# EAGLE design 640mk6 (EAGLE 7.5.0)
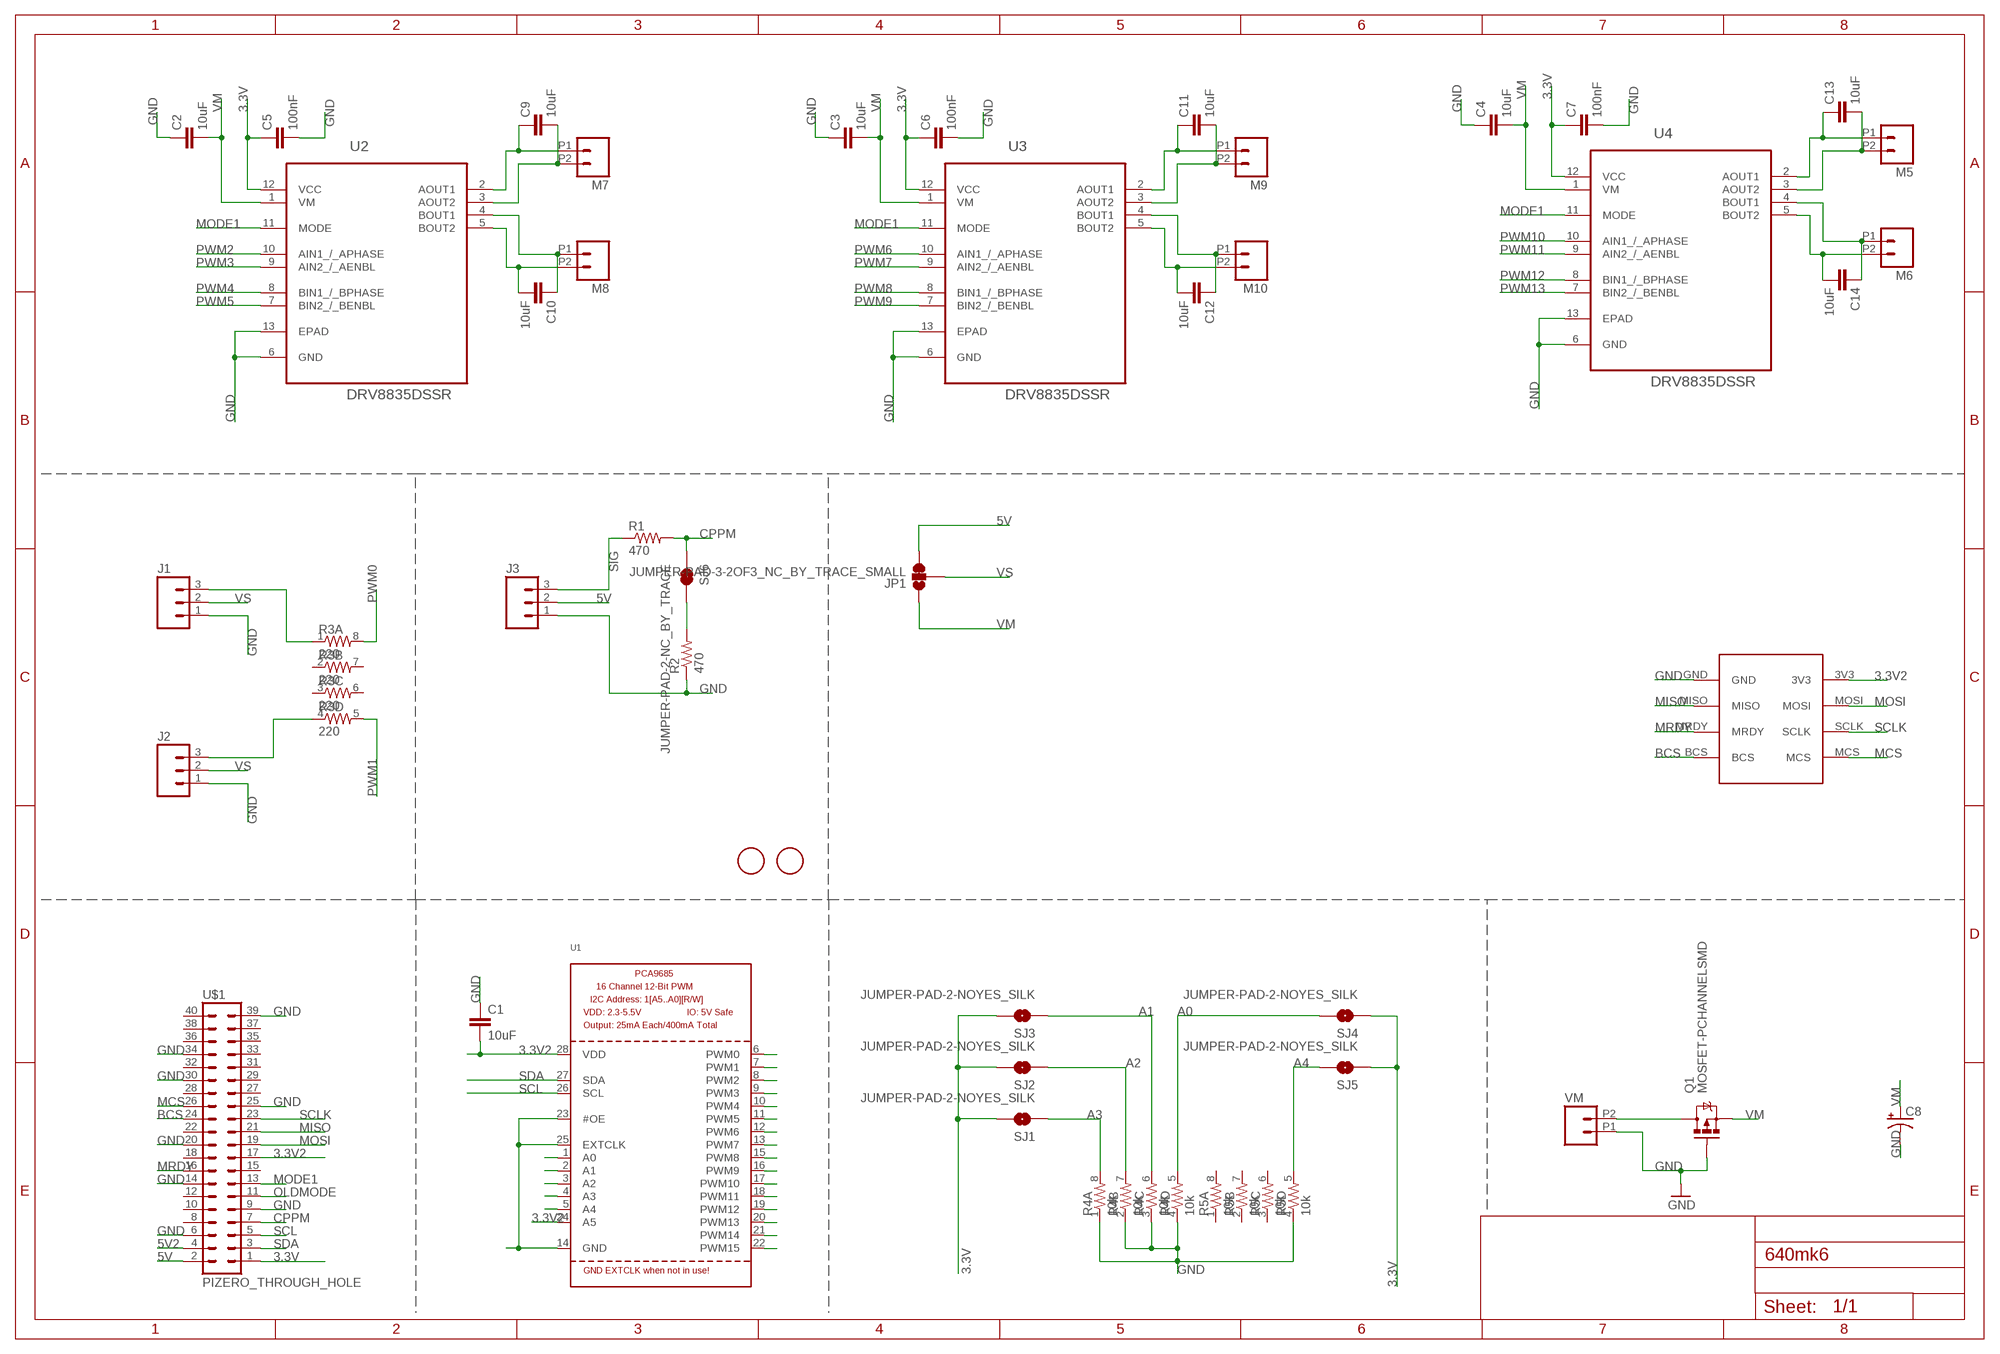
[diagram p0: schematic, sheet 1]

## Parts
C1  10uF  CAP0805  [0805]
C2  10uF  CAP0805  [0805]
C3  10uF  CAP0805  [0805]
C4  10uF  CAP0805  [0805]
C5  100nF  CAP0805  [0805]
C6  100nF  CAP0805  [0805]
C7  100nF  CAP0805  [0805]
C8  CAP_POLPTH1  [CPOL-RADIAL-100UF-25V]
C9  10uF  CAP0805  [0805]
C10  10uF  CAP0805  [0805]
C11  10uF  CAP0805  [0805]
C12  10uF  CAP0805  [0805]
C13  10uF  CAP0805  [0805]
C14  10uF  CAP0805  [0805]
FID1  FIDUCIAL  [FIDUCIAL_1MM]
FID2  FIDUCIAL  [FIDUCIAL_1MM]
J1  M03LOCK  [1X03_LOCK]
J2  M03LOCK  [1X03_LOCK]
J3  M03LOCK  [1X03_LOCK]
JP1  JUMPER-PAD-3-2OF3_NC_BY_TRACE_SMALL  [PAD-JUMPER-3-2OF3_NC_BY_TRACE_YES_SILK_FULL_BOX]
M5  M022.54MM_SCREWTERM  [1X02_2.54_SCREWTERM]
M6  M022.54MM_SCREWTERM  [1X02_2.54_SCREWTERM]
M7  M022.54MM_SCREWTERM  [1X02_2.54_SCREWTERM]
M8  M022.54MM_SCREWTERM  [1X02_2.54_SCREWTERM]
M9  M022.54MM_SCREWTERM  [1X02_2.54_SCREWTERM]
M10  M022.54MM_SCREWTERM  [1X02_2.54_SCREWTERM]
Q1  MOSFET-PCHANNELSMD  [SOT23-3]
R1  470  RESISTOR0805-RES  [0805]
R2  470  RESISTOR0805-RES  [0805]
R3  220  RESISTOR-ARRAY0603-ARV  [0603-ARV]
R4  10k  RESISTOR-ARRAY0603-ARV  [0603-ARV]
R5  10k  RESISTOR-ARRAY0603-ARV  [0603-ARV]
SJ1  JUMPER-PAD-2-NOYES_SILK  [PAD-JUMPER-2-NO_YES_SILK]
SJ2  JUMPER-PAD-2-NOYES_SILK  [PAD-JUMPER-2-NO_YES_SILK]
SJ3  JUMPER-PAD-2-NOYES_SILK  [PAD-JUMPER-2-NO_YES_SILK]
SJ4  JUMPER-PAD-2-NOYES_SILK  [PAD-JUMPER-2-NO_YES_SILK]
SJ5  JUMPER-PAD-2-NOYES_SILK  [PAD-JUMPER-2-NO_YES_SILK]
SJ6  JUMPER-PAD-2-NC_BY_TRACE  [PAD-JUMPER-2-NC_BY_TRACE_YES_SILK]
U1  PCA9685  [TSSOP28]
U2  DRV8835DSSR  [SON50P200X300X80-13N]
U3  DRV8835DSSR  [SON50P200X300X80-13N]
U4  DRV8835DSSR  [SON50P200X300X80-13N]
U$1  PIZERO_THROUGH_HOLE  [PIZERO_THOUGH_HOLE]
U$2  2X4PADS  [2X4PADS]
VM  M022.54MM_SCREWTERM  [1X02_2.54_SCREWTERM]

## Nets
3.3V: C5.1 C6.1 C7.1 SJ1.2 SJ2.2 SJ3.2 SJ4.1 SJ5.1 U2.12(VCC) U3.12(VCC) U4.12(VCC) U$1.1
3.3V2: C1.2 U1.24(A5) U1.28(VDD) U$1.17 U$2.3V3
5V: J3.2 JP1.3 U$1.2
5V2: U$1.4
A0: R4.5 SJ4.2 U1.1(A0)
A1: R4.6 SJ3.1 U1.2(A1)
A2: R4.7 SJ2.1 U1.3(A2)
A3: R4.8 SJ1.1 U1.4(A3)
A4: R5.5 SJ5.2 U1.5(A4)
BCS: U$1.24 U$2.BCS
CPPM: R1.2 SJ6.1 U$1.7
GND: C1.1 C2.1 C3.1 C4.1 C5.2 C6.2 C7.2 C8.2(-) J1.1 J2.1 J3.1 Q1.1(G) R2.1 R4.1 R4.2 R4.3 R4.4 R5.4 U1.14(GND) U1.23(#OE) U1.25(EXTCLK) U2.6(GND) U2.13(EPAD) U3.6(GND) U3.13(EPAD) U4.6(GND) U4.13(EPAD) U$1.6 U$1.9 U$1.14 U$1.20 U$1.25 U$1.30 U$1.34 U$1.39 U$2.GND VM.P1
MCS: U$1.26 U$2.MCS
MISO: U$1.21 U$2.MISO
MODE1: U2.11(MODE) U3.11(MODE) U4.11(MODE) U$1.13
MOSI: U$1.19 U$2.MOSI
MRDY: U$1.16 U$2.MRDY
N$1: R2.2 SJ6.2
N$2: J2.3 R3.4
N$4: J1.3 R3.1
N$5: Q1.3(D) VM.P2
N$10: C14.2 M6.P2 U4.5(BOUT2)
N$11: C14.1 M6.P1 U4.4(BOUT1)
N$12: C13.2 M5.P2 U4.3(AOUT2)
N$13: C13.1 M5.P1 U4.2(AOUT1)
N$14: C10.2 M8.P2 U2.5(BOUT2)
N$15: C10.1 M8.P1 U2.4(BOUT1)
N$16: C9.2 M7.P2 U2.3(AOUT2)
N$17: C9.1 M7.P1 U2.2(AOUT1)
N$18: C12.2 M10.P2 U3.5(BOUT2)
N$19: C12.1 M10.P1 U3.4(BOUT1)
N$20: C11.2 M9.P2 U3.3(AOUT2)
N$21: C11.1 M9.P1 U3.2(AOUT1)
OLDMODE: U$1.11
PWM0: R3.8 U1.6(PWM0)
PWM1: R3.5 U1.7(PWM1)
PWM2: U1.8(PWM2) U2.10(AIN1_/_APHASE)
PWM3: U1.9(PWM3) U2.9(AIN2_/_AENBL)
PWM4: U1.10(PWM4) U2.8(BIN1_/_BPHASE)
PWM5: U1.11(PWM5) U2.7(BIN2_/_BENBL)
PWM6: U1.12(PWM6) U3.10(AIN1_/_APHASE)
PWM7: U1.13(PWM7) U3.9(AIN2_/_AENBL)
PWM8: U1.15(PWM8) U3.8(BIN1_/_BPHASE)
PWM9: U1.16(PWM9) U3.7(BIN2_/_BENBL)
PWM10: U1.17(PWM10) U4.10(AIN1_/_APHASE)
PWM11: U1.18(PWM11) U4.9(AIN2_/_AENBL)
PWM12: U1.19(PWM12) U4.8(BIN1_/_BPHASE)
PWM13: U1.20(PWM13) U4.7(BIN2_/_BENBL)
PWM14: U1.21(PWM14)
PWM15: U1.22(PWM15)
SCL: U1.26(SCL) U$1.5
SCLK: U$1.23 U$2.SCLK
SDA: U1.27(SDA) U$1.3
SIG: J3.3 R1.1
VM: C2.2 C3.2 C4.2 C8.1(+) JP1.1 Q1.2(S) U2.1(VM) U3.1(VM) U4.1(VM)
VS: J1.2 J2.2 JP1.2
Unconnected: R3.2 R3.3 R3.6 R3.7 R5.1 R5.2 R5.3 R5.6 R5.7 R5.8 U$1.8 U$1.10 U$1.12 U$1.15 U$1.18 U$1.22 U$1.27 U$1.28 U$1.29 U$1.31 U$1.32 U$1.33 U$1.35 U$1.36 U$1.37 U$1.38 U$1.40

## Library data of the parts
C1-C7 C9-C14 = SparkFun-Passives:CAP: Capacitor Standard 0603 ceramic capacitor, and 0.1" leaded capacitor.
C8 = SparkFun-Passives:CAP_POL: Capacitor Polarized These are standard SMD and PTH capacitors. Normally 10uF, 47uF, and 100uF in electrolytic and tantalum varieties. Always verify the external diameter of the through hole cap, it varies with capacity, voltage, and manufacturer. The EIA devices should be standard.
FID1 FID2 = adafruit:FIDUCIAL: For use by pick and place machines to calibrate the vision/machine, 1mm By microbuilder.eu
J1-J3 = SparkFun-Connectors:M03: Header 3 Standard 3-pin 0.1" header. Use with straight break away headers (SKU : PRT-00116), right angle break away headers (PRT-00553), swiss pins (PRT-00743), machine pins (PRT-00117), and female headers (PRT-00115). Molex polarized connector foot print use with SKU : PRT-08232 with associated crimp pins and housings.
JP1 = SparkFun-Passives:JUMPER-PAD-3-2OF3_NC_BY_TRACE
M5-M10 VM = SparkFun-Connectors:M02: Standard 2-pin 0.1" header. Use with - straight break away headers ( PRT-00116) - right angle break away headers (PRT-00553) - swiss pins (PRT-00743) - machine pins (PRT-00117) - female headers (PRT-00115) Molex polarized connector foot print use with: PRT-08233 with associated crimp pins and housings. 2.54_SCREWTERM for use with PRT-10571. 3.5mm Screw Terminal footprints for PRT-08084 5mm Screw Terminal footprints for use with PRT-08432
Q1 = SparkFun-DiscreteSemi:MOSFET-PCHANNEL: Generic PMOSFET IRLML2244 - TRANS-11153 (SOT-23 -20V -4.3A) (1.Gate 2.Source 3.Drain) FQP27P06 - COM-10349 <http://www.sparkfun.com/products/10349> (TO-220 -60V -27A) (1.Gate 2.Source 3.Drain)
R1 R2 = SparkFun-Passives:RESISTOR: Resistor Basic schematic elements and footprints for 0603, 1206, and PTH resistors.
R3-R5 = SparkFun-Passives:RESISTOR-ARRAY: Array Chip Resistor Source: RS Component / Phycomp
SJ1-SJ5 = SparkFun-Passives:JUMPER-PAD-2-NO
SJ6 = SparkFun-Passives:JUMPER-PAD-2-NC_BY_TRACE
U1 = adafruit:PCA9685: PCA9685 - 16 Channel 12-Bit I2C PWM Controller 5.0V tolerant 16 channel, 12-bit I2C PWM controller with 25mA per output (max. 400mA total) Digikey: 568-5931-1-ND
U2-U4 = drv8835:DRV8835DSSR: DUAL LOW VOLTAGE H-BRIDGE IC,SON-12; MPN: DRV8835DSSR; OC_FARNELL: 2115235; OC_NEWARK: 94T6065; PACKAGE: SON-12; SUPPLIER: TEXAS INSTRUMENTS
U$1 = pizero:PIZERO_THROUGH_HOLE
U$2 = expansion:2X4PADS

## Board
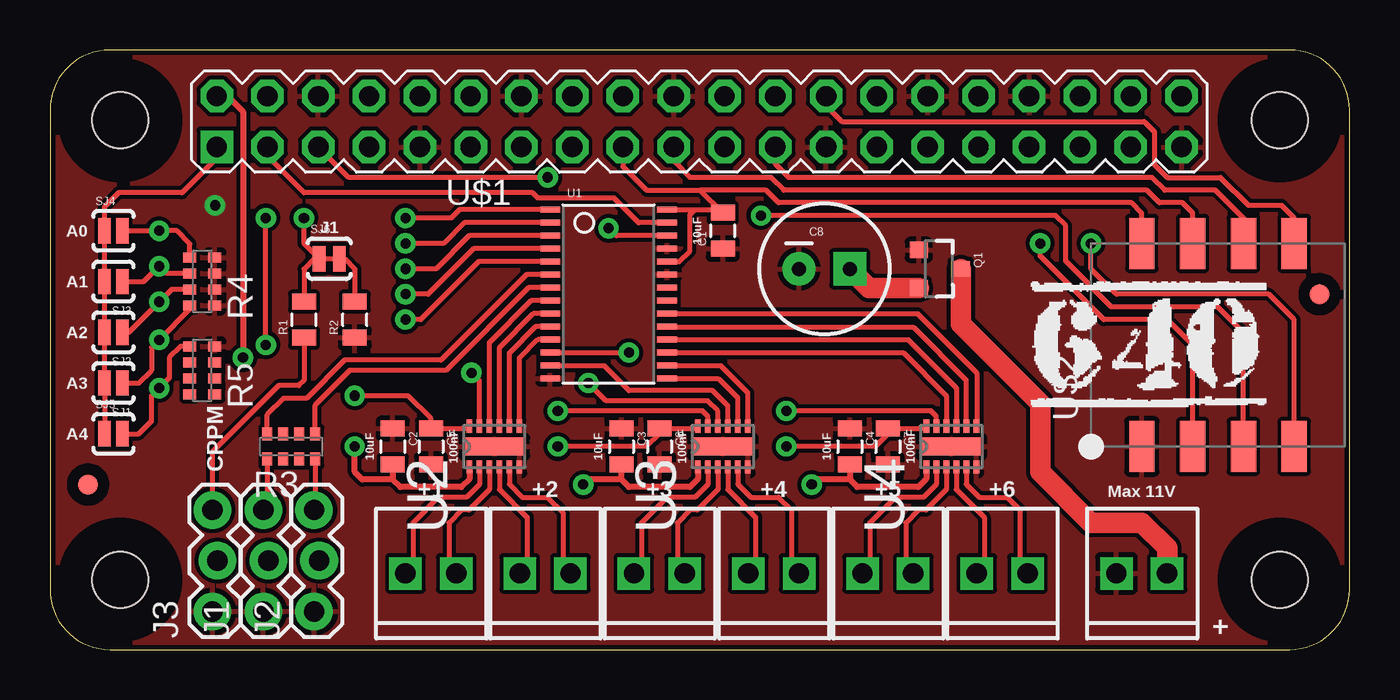
[diagram p1: board, top side]
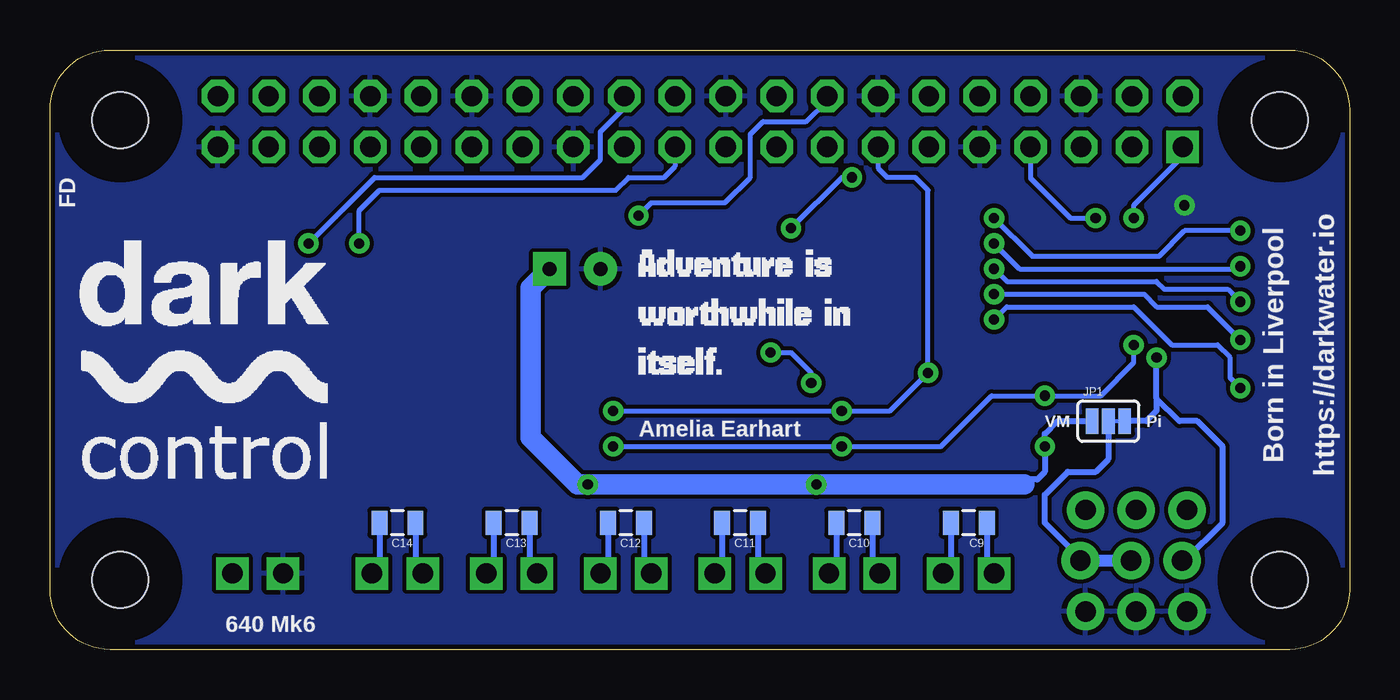
[diagram p2: board, bottom side, seen from below]

Size 65 x 30 mm. Coordinates in mm from the lower left corner, seen from the top.
Copper layers (1*16): Top 0.035mm / dielectric 1.5mm / Bottom 0.035mm
Design rules "SparkFun": minimum track width 8mil, minimum drill 20mil, track to track 8mil, track to pad 8mil, pad to pad 8mil, via to via 8mil, smd to smd 8mil, copper to edge 10mil, drill to drill 8mil, minimum pad ring 12mil, minimum via ring 10mil, stop-mask expansion 4mil, vias tented up to drill 25mil, thermal gap 10mil

### Footprints (pad centres in the part's own frame; a part is rotated, then mirrored left to right if it is on the bottom)
0805 = smd 0.8 x 1.2: 1 -0.9,0; 2 0.9,0
CPOL-RADIAL-100UF-25V = drill 0.7 pad 1.651 square: 1 1.27,0 | drill 0.7 pad 1.651: 2 -1.27,0
FIDUCIAL_1MM = smd 1 x 1: 1 0,0
1X03_LOCK = drill 1.016 pad 1.88: 1 0,0.127; 2 2.54,-0.127; 3 5.08,0.127
PAD-JUMPER-3-2OF3_NC_BY_TRACE_YES_SILK_FULL_BOX = smd 0.635 x 1.27: 1 -0.813,0; 2 0,0; 3 0.813,0
1X02_2.54_SCREWTERM = drill 1.016 square: P1 2.54,0; P2 0,0
SOT23-3 = smd 0.8 x 0.9: 1 -0.95,-1; 2 0.95,-1; 3 0,1.1
0603-ARV = smd 0.5 x 0.65: 1 -1.2,-0.625; 2 -0.4,-0.625; 3 0.4,-0.625; 4 1.2,-0.625; 5 1.2,0.625; 6 0.4,0.625; 7 -0.4,0.625; 8 -1.2,0.625
PAD-JUMPER-2-NO_YES_SILK = smd 0.635 x 1.27: 1 -0.45,0; 2 0.45,0
PAD-JUMPER-2-NC_BY_TRACE_YES_SILK = smd 0.635 x 1.27: 1 -0.508,0; 2 0.508,0
TSSOP28 = smd 0.305 x 0.991: 1 -4.225,-2.918; 2 -3.575,-2.918; 3 -2.925,-2.918; 4 -2.275,-2.918; 5 -1.625,-2.918; 6 -0.975,-2.918; 7 -0.325,-2.918; 8 0.325,-2.918; 9 0.975,-2.918; 10 1.625,-2.918; 11 2.275,-2.918; 12 2.925,-2.918; 13 3.575,-2.918; 14 4.225,-2.918; 15 4.225,2.918; 16 3.575,2.918; 17 2.925,2.918; 18 2.275,2.918; 19 1.625,2.918; 20 0.975,2.918; 21 0.325,2.918; 22 -0.325,2.918; 23 -0.975,2.918; 24 -1.625,2.918; 25 -2.275,2.918; 26 -2.925,2.918; 27 -3.575,2.918; 28 -4.225,2.918
SON50P200X300X80-13N = smd 0.66 x 0.28: 1 -1.016,1.25; 2 -1.016,0.75; 3 -1.016,0.25; 4 -1.016,-0.25; 5 -1.016,-0.75; 6 -1.016,-1.25; 7 1.016,-1.25; 8 1.016,-0.75; 9 1.016,-0.25; 10 1.016,0.25; 11 1.016,0.75; 12 1.016,1.25 | smd 0.9 x 3.099: 13 0,0
PIZERO_THOUGH_HOLE = drill 1.016 square: 1 8.34,25.15 | drill 1.016 octagon: 2 8.34,27.69; 3 10.88,25.15; 4 10.88,27.69; 5 13.42,25.15; 6 13.42,27.69; 7 15.96,25.15; 8 15.96,27.69; 9 18.5,25.15; 10 18.5,27.69; 11 21.04,25.15; 12 21.04,27.69; 13 23.58,25.15; 14 23.58,27.69; 15 26.12,25.15; 16 26.12,27.69; 17 28.66,25.15; 18 28.66,27.69; 19 31.2,25.15; 20 31.2,27.69; 21 33.74,25.15; 22 33.74,27.69; 23 36.28,25.15; 24 36.28,27.69; 25 38.82,25.15; 26 38.82,27.69; 27 41.36,25.15; 28 41.36,27.69; 29 43.9,25.15; 30 43.9,27.69; 31 46.44,25.15; 32 46.44,27.69; 33 48.98,25.15; 34 48.98,27.69; 35 51.52,25.15; 36 51.52,27.69; 37 54.06,25.15; 38 54.06,27.69; 39 56.6,25.15; 40 56.6,27.69 | hole 2.8: 3.5,3.5; 3.5,26.5; 61.5,26.5; 61.5,3.5
2X4PADS = smd 2.54 x 1.27: 3V3 5.08,3.81; BCS -5.08,-3.81; GND -5.08,3.81; MCS 5.08,-3.81; MISO -5.08,1.27; MOSI 5.08,1.27; MRDY -5.08,-1.27; SCLK 5.08,-1.27

### Placement (x,y rotation side)
C1  33.66,20.95 90 top
C2  17.14,10.16 270 top
C3  28.57,10.16 270 top
C4  40.01,10.16 270 top
C5  19.05,10.16 270 top
C6  30.48,10.16 270 top
C7  41.91,10.16 270 top
C8  38.73,19.05 0 top
C9  19.05,6.35 180 bottom
C10  24.77,6.35 180 bottom
C11  30.48,6.35 180 bottom
C12  36.2,6.35 180 bottom
C13  41.91,6.35 180 bottom
C14  47.62,6.35 180 bottom
FID1  1.91,8.26 0 top
FID2  63.5,17.78 0 top
J1  10.79,1.91 90 top
J2  13.34,1.91 90 top
J3  8.26,1.91 90 top
JP1  12.06,11.43 0 bottom
M5  43.18,3.81 180 top
M6  48.9,3.81 180 top
M7  20.32,3.81 180 top
M8  26.04,3.81 180 top
M9  31.75,3.81 180 top
M10  37.47,3.81 180 top
Q1  44.45,19.05 270 top
R1  12.7,16.51 90 top
R2  15.24,16.51 90 top
R3  12.06,10.16 0 top
R4  7.62,18.41 90 top
R5  7.62,13.97 90 top
SJ1  3.17,13.34 180 top
SJ2  3.17,15.88 180 top
SJ3  3.17,18.41 180 top
SJ4  3.17,20.95 0 top
SJ5  3.17,10.79 0 top
SJ6  13.97,19.56 0 top
U1  27.94,17.78 270 top
U2  22.23,10.16 90 top
U3  33.66,10.16 90 top
U4  45.09,10.16 90 top
U$1  0,0 0 top
U$2  58.42,15.24 90 top
U$3  [DARKCONTROLSML]  63.5,8.26 0 bottom
U$4  [640HORIZ]  48.26,11.43 0 top
U$5  [ADVENTURE]  36.96,12.95 0 bottom
VM  55.88,3.81 180 top

### Tracks (layer width: path | path; a pad name or v marks a point on that pad's centre or on a via)
3.3V  (via drill 0.51)
  Top 0.254: SJ5.1 SJ1.2 SJ2.2 SJ3.2 SJ4.1 2.73,22.16 3.43,22.86 6.6,22.86 8.38,24.64 8.38,25.11 U$1.1 | v10.79,15.24 v10.79,21.59 | v25.4,10.16 29.84,10.16 30.48,10.79 C6.1 32.29,11.06 U3.12 | v36.83,10.16 41.27,10.16 41.91,10.79 C7.1 43.72,11.06 U4.12 | U2.12 20.86,11.06 C5.1 19.05,11.56 17.91,12.7 v15.24,12.7
  Bottom 0.254: v10.79,21.59 10.79,22.23 8.34,24.68 U$1.1 | v10.79,15.24 10.79,14.35 12.45,12.7 v15.24,12.7 17.91,12.7 20.45,10.16 v25.4,10.16 v36.83,10.16
3.3V2
  Top 0.254: U1.28 32.26,22 | 32.26,22 33.51,22 C1.2 32.52,22.99 | U1.24 31.47,19.41 32,19.94 32,21.75 32.26,22 | U$2.3V3 54.61,21.84 54.1,22.35 36.45,22.35 35.81,22.99 32.52,22.99 | U$1.17 28.66,24.17 29.84,22.99 32.52,22.99
5V  (via drill 0.51)
  Top 0.305: U$1.2 8.89,27.69 9.65,26.92 v9.65,14.61
  Bottom 0.305: J3.2 8.26,4.45 6.35,6.35 6.35,10.16 7.62,11.43 8.51,11.43 9.65,12.57 | 9.65,12.57 v9.65,14.61 | 9.65,12.57 9.65,11.94 10.16,11.43 JP1.3
A0  (via drill 0.51)
  Top 0.254: 6.99,19.62 R4.5 7,20.31 6.35,20.95 v5.46,20.95 SJ4.2 | U1.1 20.48,22 20.07,21.59 v17.78,21.59
  Bottom 0.254: v5.46,20.95 8.26,20.95 9.53,19.68 15.88,19.68 v17.78,21.59
A1  (via drill 0.51)
  Top 0.254: SJ3.1 4.7,18.41 v5.46,19.18 5.82,18.82 R4.6 | U1.2 20.72,21.36 19.68,20.32 v17.78,20.32
  Bottom 0.254: v5.46,19.18 5.59,19.05 16.51,19.05 v17.78,20.32
A2  (via drill 0.51)
  Top 0.254: SJ2.1 3.94,15.88 v5.46,17.4 6.08,18.02 R4.7 | U1.3 20.96,20.7 19.3,19.05 v17.78,19.05
  Bottom 0.254: 5.84,17.78 v5.46,17.4 6.1,18.03 9.27,18.03 9.65,18.41 17.14,18.41 v17.78,19.05
A3  (via drill 0.51)
  Top 0.254: SJ1.1 4.45,13.34 5.08,13.97 5.08,15.11 v5.46,15.49 7,17.03 R4.8 | U1.4 21.2,20.05 18.92,17.78 v17.78,17.78
  Bottom 0.254: 6.6,16.64 v5.46,15.49 7.11,17.14 9.65,17.14 10.29,17.78 v17.78,17.78
A4  (via drill 0.51)
  Top 0.254: SJ5.2 4.45,10.79 5.08,11.43 5.08,12.7 v5.46,13.08 5.97,13.59 5.97,14.61 6.53,15.17 R5.5 | U1.5 21.44,19.41 18.54,16.51 v17.78,16.51
  Bottom 0.254: v5.46,13.08 5.97,13.59 5.97,14.61 6.6,15.24 8.89,15.24 10.79,17.14 17.14,17.14 v17.78,16.51
BCS  (via drill 0.51)
  Top 0.254: U$2.BCS 62.23,16.51 60.96,17.78 53.34,17.78 52.07,19.05 v52.07,20.32
  Bottom 0.254: v52.07,20.32 48.77,23.62 38.35,23.62 37.47,24.51 37.47,25.91 36.28,27.09 U$1.24
CPPM  (via drill 0.51)
  Top 0.254: v12.7,21.59 12.7,20.32 SJ6.1 13.21,19.56 12.7,19.05 R1.2
  Bottom 0.254: U$1.7 15.96,23.58 13.97,21.59 v12.7,21.59
GND  (via drill 0.51)
  other vias: 8.26,22.23
  pour Bottom: 0,27.3 0,2.54 arc90 2.54,0 62.23,0 arc90 64.77,2.54 64.77,27.3 arc90 62.23,29.84 2.54,29.84 arc90
  pour Top: 0,27.3 0,2.54 arc90 2.54,0 62.23,0 arc90 64.77,2.54 64.77,27.3 arc90 62.23,29.84 2.54,29.84 arc90
MCS
  Top 0.254: U$1.26 38.82,27.22 39.62,26.42 54.74,26.42 55.24,25.91 55.24,24.26 55.88,23.62 58.55,23.62 59.94,22.23 61.59,22.23 62.23,21.59 U$2.MCS
MISO  (via drill 0.51)
  Top 0.254: U$2.MISO 57.15,15.24 55.88,16.51 52.7,16.51 49.53,19.68 v49.53,20.32
  Bottom 0.254: v49.53,20.32 49.53,21.97 48.51,22.99 36.7,22.99 36.07,23.62 34.29,23.62 33.74,24.17 U$1.21
MODE1  (via drill 0.51)
  Top 0.254: U3.11 32.91,11.67 32.64,11.94 v25.4,11.94 | U2.11 21.48,13.45 v21.08,13.84 | U4.11 44.34,11.67 44.07,11.94 v36.83,11.94
  Bottom 0.254: v36.83,11.94 v25.4,11.94 22.99,11.94 v21.08,13.84 21.08,22.99 21.72,23.62 23.11,23.62 23.58,24.09 U$1.13
MOSI
  Top 0.254: U$2.MOSI 57.15,21.84 56.64,22.35 55.5,22.35 54.86,22.99 36.7,22.99 36.07,23.62 32,23.62 31.2,24.43 U$1.19
MRDY  (via drill 0.51)
  Top 0.254: U$2.MRDY 59.69,15.88 58.42,17.14 53.09,17.14 50.8,19.43 50.8,21.21 50.29,21.72 v35.56,21.72
  Bottom 0.254: v35.56,21.72 34.92,22.35 31.24,22.35 29.97,23.62 29.97,25.78 29.34,26.42 27.18,26.42 26.12,27.47 U$1.16
N$1
  Top 0.254: SJ6.2 14.73,19.56 15.24,19.05 R2.2
N$2
  Top 0.254: R3.4 13.27,7.04 J2.3
N$4
  Top 0.254: R3.1 10.87,7.18 J1.3
N$5
  Top 1.016: Q1.3 45.55,16.3 49.53,12.32 49.53,8.89 52.07,6.35 54.61,6.35 55.88,5.08 VM.P2
N$10
  Top 0.254: U4.5 45.84,8.27 46.48,7.62 47.88,7.62 48.51,6.99 48.51,4.19 M6.P2
  Bottom 0.305: C14.2 48.52,4.18 M6.P2
N$11
  Top 0.254: U4.4 45.34,8.01 46.73,6.62 46.73,4.18 M6.P1
  Bottom 0.305: C14.1 46.73,4.18 M6.P1
N$12
  Top 0.254: U4.3 44.84,8.01 43.81,6.99 43.45,6.99 C13.2 42.81,4.18 M5.P2
  Bottom 0.305: C13.2 42.81,4.18 M5.P2
N$13
  Top 0.254: U4.2 44.34,8.27 43.69,7.62 42.28,7.62 C13.1 41.01,4.18 M5.P1
  Bottom 0.305: C13.1 41.01,4.18 M5.P1
N$14
  Top 0.254: U2.5 22.98,8.27 23.62,7.62 24.89,7.62 25.65,6.86 25.65,4.19 M8.P2
  Bottom 0.305: C10.2 25.66,4.18 M8.P2
N$15
  Top 0.254: U2.4 22.48,8.01 23.86,6.62 23.86,4.18 M8.P1
  Bottom 0.305: C10.1 23.86,4.18 M8.P1
N$16
  Top 0.254: U2.3 21.98,8.01 20.95,6.99 20.59,6.99 C9.2 19.95,4.18 M7.P2
  Bottom 0.305: C9.2 19.95,4.18 M7.P2
N$17
  Top 0.254: U2.2 21.48,8.27 20.83,7.62 19.42,7.62 C9.1 18.15,4.18 M7.P1
  Bottom 0.305: C9.1 18.15,4.18 M7.P1
N$18
  Top 0.254: U3.5 34.41,8.27 35.05,7.62 36.45,7.62 37.08,6.99 37.08,4.19 M10.P2
  Bottom 0.305: C12.2 37.09,4.18 M10.P2
N$19
  Top 0.254: U3.4 33.91,8.01 35.3,6.62 35.3,4.18 M10.P1
  Bottom 0.305: C12.1 35.3,4.18 M10.P1
N$20
  Top 0.254: U3.3 33.41,8.01 32.38,6.99 32.02,6.99 C11.2 31.38,4.18 M9.P2
  Bottom 0.305: C11.2 31.38,4.18 M9.P2
N$21
  Top 0.254: U3.2 32.91,8.27 32.26,7.62 30.85,7.62 C11.1 29.58,4.18 M9.P1
  Bottom 0.305: C11.1 29.58,4.18 M9.P1
PWM0
  Top 0.254: U1.6 23.84,18.75 19.56,14.48 14.73,14.48 12.83,12.57 11.68,12.57 10.87,11.75 R3.8
PWM1
  Top 0.254: U1.7 23.95,18.11 19.81,13.97 14.99,13.97 13.27,12.25 R3.5
PWM2
  Top 0.254: U2.10 21.98,15.37 24.06,17.45 U1.8
PWM3
  Top 0.254: U2.9 22.48,15.11 24.17,16.8 U1.9
PWM4
  Top 0.254: U2.8 22.98,14.85 24.28,16.16 U1.10
PWM5
  Top 0.254: U2.7 23.48,14.59 24.39,15.51 U1.11
PWM6  (via drill 0.51)
  Top 0.254: U3.10 33.41,11.93 32.89,12.45 27.81,12.45 v26.92,13.34 | U1.12 v28.95,14.86 v28.96,14.86
  Bottom 0.254: v26.92,13.34 26.92,13.84 27.94,14.86 v28.96,14.86
PWM7
  Top 0.254: U1.13 27.7,14.21 28.96,12.95 33.15,12.95 33.91,12.2 U3.9
PWM8
  Top 0.254: U1.15 33.44,13.55 34.41,12.59 U3.8
PWM9
  Top 0.254: U1.16 33.55,14.21 34.91,12.85 U3.7
PWM10
  Top 0.254: U1.17 42.68,14.86 44.83,12.7 U4.10
PWM11
  Top 0.254: U1.18 42.91,15.51 45.34,13.08 U4.9
PWM12
  Top 0.254: U4.8 45.84,13.47 43.18,16.13 30.88,16.13 U1.19
PWM13
  Top 0.254: U1.20 43.39,16.8 46.35,13.84 46.35,11.2 U4.7
SCL  (via drill 0.51)
  Top 0.254: v24.89,23.62 14.95,23.62 U$1.5 | U1.26 28.32,20.7 v27.94,21.08
  Bottom 0.254: v24.89,23.62 25.4,23.62 v27.94,21.08
SCLK
  Top 0.254: U$2.SCLK 59.69,21.59 58.29,22.99 55.75,22.99 55.12,23.62 36.96,23.62 36.28,24.3 U$1.23
SDA
  Top 0.254: U$1.3 10.88,24.68 12.7,22.86 24.13,22.86 24.38,22.61 28.19,22.61 29.45,21.36 U1.27
SIG
  Top 0.254: R1.1 12.7,13.46 12.45,13.21 11.43,13.21 8.13,9.91 J3.3
VM  (via drill 0.51)
  Top 0.305: U4.1 43.84,8.53 43.43,8.13 40.39,8.13 40.01,8.51 | C4.2 40.01,8.51 | U3.1 32.41,8.53 32,8.13 28.96,8.13 28.57,8.51 | U2.1 20.98,8.53 20.57,8.13 17.53,8.13 17.14,8.51 | 40.01,8.51 38.35,8.51 v38.1,8.26 | 28.57,8.51 26.92,8.51 v26.67,8.26 | 28.57,8.51 C3.2 | 17.14,8.51 15.62,8.51 15.24,8.89 v15.24,10.16 | C2.2 17.14,8.51
  Top 1.016: Q1.2 40.95,18.1 C8.1
  Bottom 0.305: 16.51,8.51 16.26,8.26 16,8.51 15.62,8.51 15.24,8.89 v15.24,10.16 15.24,10.79 14.61,11.43 JP1.1
  Bottom 1.016: 16.26,8.26 v26.67,8.26 v38.1,8.26 38.61,8.26 40.95,10.6 40.95,18.1 C8.1
VS
  Bottom 0.305: J1.2 13.34,4.45 15.24,6.35 15.24,7.75 14.1,8.89 12.7,8.89 12.06,9.53 JP1.2
  Bottom 0.61: J1.2 J2.2

### Text on the board
tPlace: A0 | J1 | 10uF | A1 | A2 | A3 | A4 | 10uF | 100nF | 10uF | 100nF | 10uF | 100nF | CPPM | +1 | +2 | +3 | +4 | +5 | +6 | Max 11V | +
bPlace: FD | https://darkwater.io | Born in Liverpool | Pi | VM | Amelia Earhart | 640 Mk6